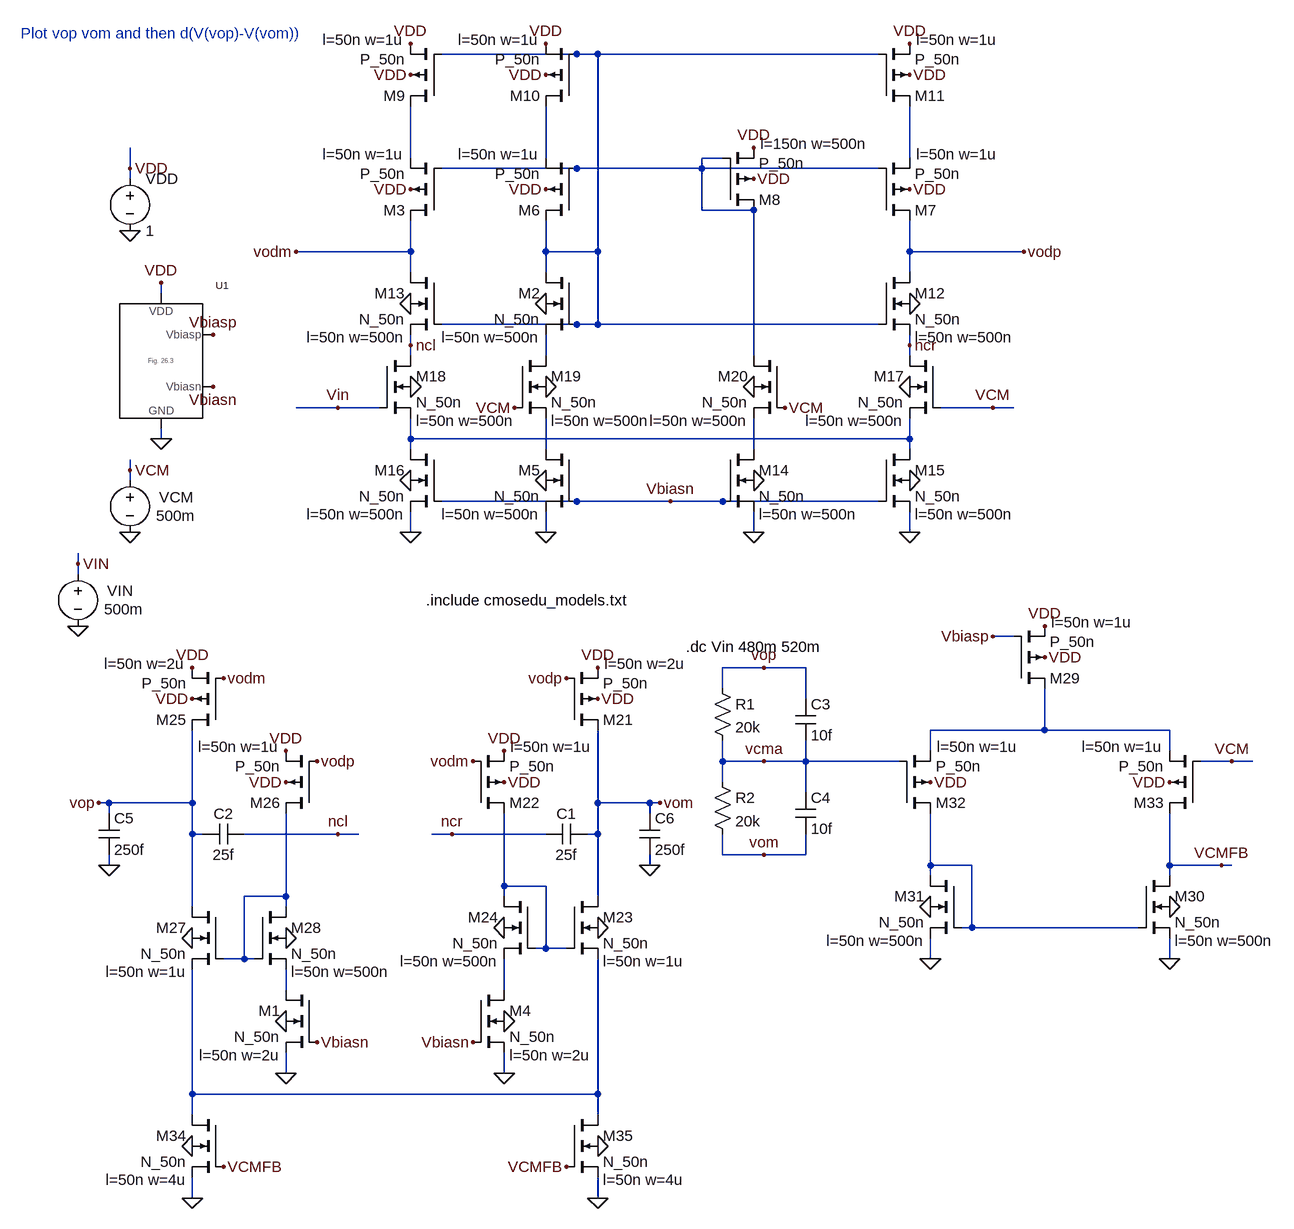
[diagram p0: schematic Fig26_44_DC.asc]
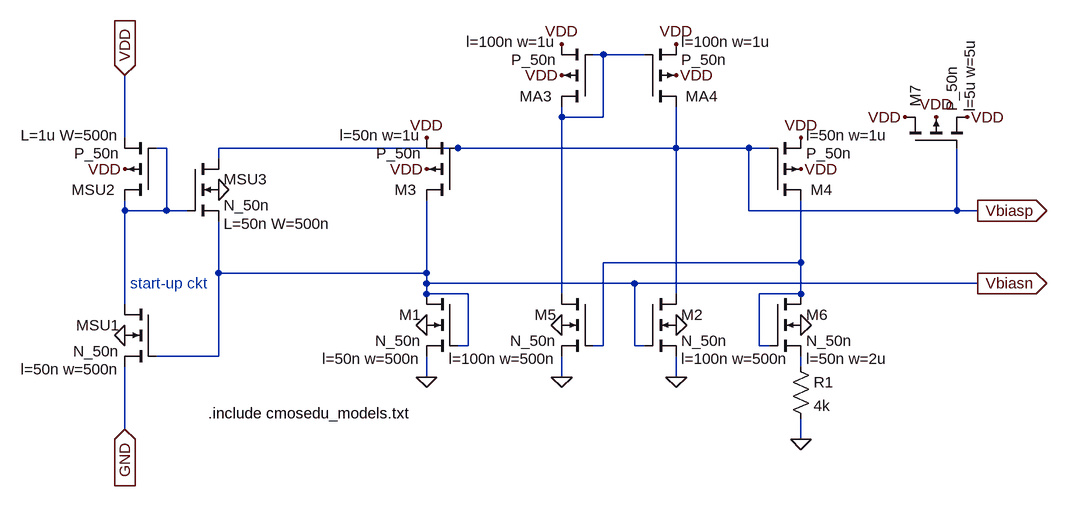
[diagram p1: sub-circuit fig_26_3.asc]
Fig26_44_DC.asc, the LTspice schematic file:
Version 4
SHEET 1 3220 1236
WIRE 1440 -544 1232 -544
WIRE 1472 -544 1440 -544
WIRE 1904 -544 1472 -544
WIRE 1184 -384 1184 -464
WIRE 1392 -384 1392 -464
WIRE 1664 -384 1632 -384
WIRE 1952 -384 1952 -464
WIRE 752 -368 752 -400
WIRE 1440 -368 1232 -368
WIRE 1632 -368 1632 -384
WIRE 1632 -368 1440 -368
WIRE 1904 -368 1632 -368
WIRE 752 -352 752 -368
WIRE 1632 -304 1632 -368
WIRE 1712 -304 1632 -304
WIRE 1184 -240 1184 -288
WIRE 1184 -240 1008 -240
WIRE 1392 -240 1392 -288
WIRE 1472 -240 1472 -544
WIRE 1472 -240 1392 -240
WIRE 1952 -240 1952 -288
WIRE 2128 -240 1952 -240
WIRE 1184 -208 1184 -240
WIRE 1392 -208 1392 -240
WIRE 1952 -208 1952 -240
WIRE 800 -176 800 -192
WIRE 1440 -128 1232 -128
WIRE 1472 -128 1472 -240
WIRE 1472 -128 1440 -128
WIRE 1904 -128 1472 -128
WIRE 1184 -96 1184 -112
WIRE 1952 -96 1952 -112
WIRE 1184 -80 1184 -96
WIRE 1392 -80 1392 -112
WIRE 1712 -80 1712 -304
WIRE 1952 -80 1952 -96
WIRE 1072 0 1008 0
WIRE 1136 0 1072 0
WIRE 2080 0 2000 0
WIRE 2112 0 2080 0
WIRE 800 48 800 32
WIRE 1184 48 1184 16
WIRE 1952 48 1952 16
WIRE 1952 48 1184 48
WIRE 1184 64 1184 48
WIRE 1392 64 1392 16
WIRE 1712 64 1712 16
WIRE 1952 64 1952 48
WIRE 752 96 752 80
WIRE 752 112 752 96
WIRE 1440 144 1232 144
WIRE 1584 144 1440 144
WIRE 1664 144 1584 144
WIRE 1904 144 1664 144
WIRE 1184 192 1184 160
WIRE 1392 192 1392 160
WIRE 1712 192 1712 160
WIRE 1952 192 1952 160
WIRE 672 240 672 224
WIRE 672 256 672 240
WIRE 2112 352 2080 352
WIRE 1728 400 1664 400
WIRE 1792 400 1728 400
WIRE 1664 432 1664 400
WIRE 1792 448 1792 400
WIRE 2160 496 2160 432
WIRE 2160 496 1984 496
WIRE 2352 496 2160 496
WIRE 1984 528 1984 496
WIRE 2352 528 2352 496
WIRE 1664 544 1664 512
WIRE 1728 544 1664 544
WIRE 1792 544 1792 512
WIRE 1792 544 1728 544
WIRE 1936 544 1792 544
WIRE 2448 544 2400 544
WIRE 2480 544 2448 544
WIRE 1664 576 1664 544
WIRE 1792 592 1792 544
WIRE 720 608 704 608
WIRE 848 608 848 496
WIRE 848 608 720 608
WIRE 1472 608 1472 496
WIRE 1552 608 1472 608
WIRE 1568 608 1552 608
WIRE 720 624 720 608
WIRE 1552 624 1552 608
WIRE 848 656 848 608
WIRE 864 656 848 656
WIRE 1072 656 928 656
WIRE 1104 656 1072 656
WIRE 1248 656 1216 656
WIRE 1392 656 1248 656
WIRE 1472 656 1472 608
WIRE 1472 656 1456 656
WIRE 1664 688 1664 656
WIRE 1728 688 1664 688
WIRE 1792 688 1792 656
WIRE 1792 688 1728 688
WIRE 720 704 720 688
WIRE 1552 704 1552 688
WIRE 1984 704 1984 624
WIRE 2048 704 1984 704
WIRE 2352 704 2352 624
WIRE 2432 704 2352 704
WIRE 2448 704 2432 704
WIRE 1984 720 1984 704
WIRE 2352 720 2352 704
WIRE 1328 736 1328 624
WIRE 1392 736 1328 736
WIRE 992 752 992 624
WIRE 992 752 928 752
WIRE 1328 752 1328 736
WIRE 1472 752 1472 656
WIRE 848 768 848 656
WIRE 992 768 992 752
WIRE 2048 800 2048 704
WIRE 2048 800 2032 800
WIRE 2304 800 2048 800
WIRE 1392 832 1392 736
WIRE 1392 832 1376 832
WIRE 1424 832 1392 832
WIRE 928 848 928 752
WIRE 928 848 896 848
WIRE 944 848 928 848
WIRE 1984 848 1984 816
WIRE 2352 848 2352 816
WIRE 992 896 992 864
WIRE 1328 896 1328 848
WIRE 992 1024 992 992
WIRE 1328 1024 1328 992
WIRE 848 1056 848 864
WIRE 1472 1056 1472 848
WIRE 1472 1056 848 1056
WIRE 848 1088 848 1056
WIRE 1472 1088 1472 1056
WIRE 848 1216 848 1184
WIRE 1472 1216 1472 1184
FLAG 752 -272 0
FLAG 752 -368 VDD
FLAG 1392 -160 0
FLAG 1184 -336 VDD
FLAG 800 -192 VDD
FLAG 800 48 0
FLAG 752 192 0
FLAG 880 -32 Vbiasn
FLAG 880 -112 Vbiasp
FLAG 752 96 VCM
FLAG 1392 -336 VDD
FLAG 1952 -336 VDD
FLAG 1712 -400 VDD
FLAG 1712 -352 VDD
FLAG 1184 -512 VDD
FLAG 1184 -560 VDD
FLAG 1392 -512 VDD
FLAG 1392 -560 VDD
FLAG 1952 -560 VDD
FLAG 1952 -512 VDD
FLAG 1952 -160 0
FLAG 1184 -160 0
FLAG 1392 112 0
FLAG 1712 112 0
FLAG 1952 112 0
FLAG 1184 112 0
FLAG 1952 -32 0
FLAG 1184 -32 0
FLAG 1392 -32 0
FLAG 1712 -32 0
FLAG 1184 192 0
FLAG 1584 144 Vbiasn
FLAG 2128 -240 vodp
FLAG 1008 -240 vodm
FLAG 1072 0 Vin
FLAG 2080 0 VCM
FLAG 1952 -96 ncr
FLAG 1184 -96 ncl
FLAG 1472 400 VDD
FLAG 1472 448 VDD
FLAG 1328 528 VDD
FLAG 1328 576 VDD
FLAG 1472 800 0
FLAG 1328 800 0
FLAG 1248 656 ncr
FLAG 1424 416 vodp
FLAG 1280 544 vodm
FLAG 848 400 VDD
FLAG 848 448 VDD
FLAG 992 528 VDD
FLAG 992 576 VDD
FLAG 848 816 0
FLAG 992 816 0
FLAG 1072 656 ncl
FLAG 896 416 vodm
FLAG 1040 544 vodp
FLAG 1392 192 0
FLAG 1952 192 0
FLAG 1712 192 0
FLAG 1728 400 vop
FLAG 1728 688 vom
FLAG 1728 544 vcma
FLAG 2352 848 0
FLAG 2160 336 VDD
FLAG 2160 384 VDD
FLAG 2352 768 0
FLAG 1984 848 0
FLAG 1984 768 0
FLAG 2080 352 Vbiasp
FLAG 1984 576 VDD
FLAG 2352 576 VDD
FLAG 2448 544 VCM
FLAG 848 1136 0
FLAG 896 1168 VCMFB
FLAG 1472 1136 0
FLAG 1424 1168 VCMFB
FLAG 704 608 vop
FLAG 720 704 0
FLAG 1568 608 vom
FLAG 1552 704 0
FLAG 2432 704 VCMFB
FLAG 1344 0 VCM
FLAG 1760 0 VCM
FLAG 992 944 0
FLAG 1040 976 Vbiasn
FLAG 992 1024 0
FLAG 1328 944 0
FLAG 1280 976 Vbiasn
FLAG 1328 1024 0
FLAG 1472 1216 0
FLAG 848 1216 0
FLAG 672 336 0
FLAG 672 240 VIN
SYMBOL voltage 752 -368 R0
WINDOW 123 0 0 Left 2
WINDOW 39 0 0 Left 2
SYMATTR InstName VDD
SYMATTR Value 1
SYMBOL nmos4 1440 -208 M0
WINDOW 123 56 100 Left 2
SYMATTR Value2 l=50n w=500n
SYMATTR InstName M2
SYMATTR Value N_50n
SYMBOL pmos4 1232 -288 R180
WINDOW 123 58 102 Left 2
WINDOW 0 56 16 Left 2
SYMATTR Value2 l=50n w=1u
SYMATTR InstName M3
SYMATTR Value P_50n
SYMBOL voltage 752 96 R0
WINDOW 0 45 42 Left 2
WINDOW 3 40 70 Left 2
WINDOW 123 0 0 Left 2
WINDOW 39 0 0 Left 2
SYMATTR InstName VCM
SYMATTR Value 500m
SYMBOL Fig_26_3 736 -64 R0
SYMATTR InstName U1
SYMBOL pmos4 1440 -288 R180
WINDOW 123 58 102 Left 2
WINDOW 0 56 16 Left 2
SYMATTR Value2 l=50n w=1u
SYMATTR InstName M6
SYMATTR Value P_50n
SYMBOL pmos4 1904 -288 M180
WINDOW 123 58 102 Left 2
WINDOW 0 56 16 Left 2
SYMATTR Value2 l=50n w=1u
SYMATTR InstName M7
SYMATTR Value P_50n
SYMBOL pmos4 1664 -304 M180
WINDOW 123 58 102 Left 2
WINDOW 0 56 16 Left 2
SYMATTR Value2 l=150n w=500n
SYMATTR InstName M8
SYMATTR Value P_50n
SYMBOL pmos4 1232 -464 R180
WINDOW 123 58 102 Left 2
WINDOW 0 56 16 Left 2
SYMATTR Value2 l=50n w=1u
SYMATTR InstName M9
SYMATTR Value P_50n
SYMBOL pmos4 1440 -464 R180
WINDOW 123 58 102 Left 2
WINDOW 0 56 16 Left 2
SYMATTR Value2 l=50n w=1u
SYMATTR InstName M10
SYMATTR Value P_50n
SYMBOL pmos4 1904 -464 M180
WINDOW 123 58 102 Left 2
WINDOW 0 56 16 Left 2
SYMATTR Value2 l=50n w=1u
SYMATTR InstName M11
SYMATTR Value P_50n
SYMBOL nmos4 1904 -208 R0
WINDOW 123 56 100 Left 2
SYMATTR Value2 l=50n w=500n
SYMATTR InstName M12
SYMATTR Value N_50n
SYMBOL nmos4 1232 -208 M0
WINDOW 123 56 100 Left 2
SYMATTR Value2 l=50n w=500n
SYMATTR InstName M13
SYMATTR Value N_50n
SYMBOL nmos4 1440 64 M0
WINDOW 123 56 100 Left 2
SYMATTR Value2 l=50n w=500n
SYMATTR InstName M5
SYMATTR Value N_50n
SYMBOL nmos4 1664 64 R0
WINDOW 123 56 100 Left 2
SYMATTR Value2 l=50n w=500n
SYMATTR InstName M14
SYMATTR Value N_50n
SYMBOL nmos4 1904 64 R0
WINDOW 123 56 100 Left 2
SYMATTR Value2 l=50n w=500n
SYMATTR InstName M15
SYMATTR Value N_50n
SYMBOL nmos4 1232 64 M0
WINDOW 123 56 100 Left 2
SYMATTR Value2 l=50n w=500n
SYMATTR InstName M16
SYMATTR Value N_50n
SYMBOL nmos4 2000 -80 M0
WINDOW 123 56 100 Left 2
SYMATTR Value2 l=50n w=500n
SYMATTR InstName M17
SYMATTR Value N_50n
SYMBOL nmos4 1136 -80 R0
WINDOW 123 56 100 Left 2
SYMATTR Value2 l=50n w=500n
SYMATTR InstName M18
SYMATTR Value N_50n
SYMBOL nmos4 1344 -80 R0
WINDOW 123 56 100 Left 2
SYMATTR Value2 l=50n w=500n
SYMATTR InstName M19
SYMATTR Value N_50n
SYMBOL nmos4 1760 -80 M0
WINDOW 123 56 100 Left 2
SYMATTR Value2 l=50n w=500n
SYMATTR InstName M20
SYMATTR Value N_50n
SYMBOL pmos4 1424 496 M180
WINDOW 123 58 102 Left 2
WINDOW 0 56 16 Left 2
SYMATTR Value2 l=50n w=2u
SYMATTR InstName M21
SYMATTR Value P_50n
SYMBOL pmos4 1280 624 M180
WINDOW 123 58 102 Left 2
WINDOW 0 56 16 Left 2
SYMATTR Value2 l=50n w=1u
SYMATTR InstName M22
SYMATTR Value P_50n
SYMBOL nmos4 1424 752 R0
WINDOW 123 56 100 Left 2
SYMATTR Value2 l=50n w=1u
SYMATTR InstName M23
SYMATTR Value N_50n
SYMBOL nmos4 1376 752 M0
WINDOW 123 56 100 Left 2
SYMATTR Value2 l=50n w=500n
SYMATTR InstName M24
SYMATTR Value N_50n
SYMBOL cap 1456 640 R90
WINDOW 0 0 32 VBottom 2
WINDOW 3 32 32 VTop 2
SYMATTR InstName C1
SYMATTR Value 25f
SYMBOL pmos4 896 496 R180
WINDOW 123 58 102 Left 2
WINDOW 0 56 16 Left 2
SYMATTR Value2 l=50n w=2u
SYMATTR InstName M25
SYMATTR Value P_50n
SYMBOL pmos4 1040 624 R180
WINDOW 123 58 102 Left 2
WINDOW 0 56 16 Left 2
SYMATTR Value2 l=50n w=1u
SYMATTR InstName M26
SYMATTR Value P_50n
SYMBOL nmos4 896 768 M0
WINDOW 123 56 100 Left 2
SYMATTR Value2 l=50n w=1u
SYMATTR InstName M27
SYMATTR Value N_50n
SYMBOL nmos4 944 768 R0
WINDOW 123 56 100 Left 2
SYMATTR Value2 l=50n w=500n
SYMATTR InstName M28
SYMATTR Value N_50n
SYMBOL cap 864 640 M90
WINDOW 0 0 32 VBottom 2
WINDOW 3 32 32 VTop 2
SYMATTR InstName C2
SYMATTR Value 25f
SYMBOL res 1648 416 R0
SYMATTR InstName R1
SYMATTR Value 20k
SYMBOL res 1648 560 R0
SYMATTR InstName R2
SYMATTR Value 20k
SYMBOL cap 1776 448 R0
SYMATTR InstName C3
SYMATTR Value 10f
SYMBOL cap 1776 592 R0
SYMATTR InstName C4
SYMATTR Value 10f
SYMBOL pmos4 2112 432 M180
WINDOW 123 58 102 Left 2
WINDOW 0 56 16 Left 2
SYMATTR Value2 l=50n w=1u
SYMATTR InstName M29
SYMATTR Value P_50n
SYMBOL nmos4 2304 720 R0
WINDOW 123 56 100 Left 2
SYMATTR Value2 l=50n w=500n
SYMATTR InstName M30
SYMATTR Value N_50n
SYMBOL nmos4 2032 720 M0
WINDOW 123 56 100 Left 2
SYMATTR Value2 l=50n w=500n
SYMATTR InstName M31
SYMATTR Value N_50n
SYMBOL pmos4 1936 624 M180
WINDOW 123 58 102 Left 2
WINDOW 0 56 16 Left 2
SYMATTR Value2 l=50n w=1u
SYMATTR InstName M32
SYMATTR Value P_50n
SYMBOL pmos4 2400 624 R180
WINDOW 123 58 102 Left 2
WINDOW 0 56 16 Left 2
SYMATTR Value2 l=50n w=1u
SYMATTR InstName M33
SYMATTR Value P_50n
SYMBOL nmos4 896 1088 M0
WINDOW 123 56 100 Left 2
SYMATTR Value2 l=50n w=4u
SYMATTR InstName M34
SYMATTR Value N_50n
SYMBOL nmos4 1424 1088 R0
WINDOW 123 56 100 Left 2
SYMATTR Value2 l=50n w=4u
SYMATTR InstName M35
SYMATTR Value N_50n
SYMBOL cap 704 624 R0
SYMATTR InstName C5
SYMATTR Value 250f
SYMBOL cap 1536 624 R0
SYMATTR InstName C6
SYMATTR Value 250f
SYMBOL nmos4 1040 896 M0
WINDOW 123 56 100 Left 2
SYMATTR Value2 l=50n w=2u
SYMATTR InstName M1
SYMATTR Value N_50n
SYMBOL nmos4 1280 896 R0
WINDOW 123 56 100 Left 2
SYMATTR Value2 l=50n w=2u
SYMATTR InstName M4
SYMATTR Value N_50n
SYMBOL voltage 672 240 R0
WINDOW 0 45 42 Left 2
WINDOW 3 40 70 Left 2
WINDOW 123 0 0 Left 2
WINDOW 39 0 0 Left 2
SYMATTR InstName VIN
SYMATTR Value 500m
TEXT 1208 296 Left 2 !.include cmosedu_models.txt
TEXT 1608 368 Left 2 !.dc Vin 480m 520m
TEXT 584 -576 Left 2 ;Plot vop vom and then d(V(vop)-V(vom))

fig_26_3.asc, the sub-circuit schematic file:
Version 4
SHEET 1 2004 680
WIRE 1280 -304 1264 -304
WIRE 1344 -304 1280 -304
WIRE 1216 -208 1216 -224
WIRE 1280 -208 1280 -304
WIRE 1280 -208 1216 -208
WIRE 544 -176 544 -272
WIRE 608 -160 592 -160
WIRE 1056 -160 688 -160
WIRE 1392 -160 1392 -224
WIRE 1392 -160 1056 -160
WIRE 1504 -160 1392 -160
WIRE 1536 -160 1504 -160
WIRE 688 -144 688 -160
WIRE 544 -64 544 -80
WIRE 608 -64 608 -160
WIRE 608 -64 544 -64
WIRE 640 -64 608 -64
WIRE 1504 -64 1504 -160
WIRE 1824 -64 1824 -160
WIRE 1824 -64 1504 -64
WIRE 1856 -64 1824 -64
WIRE 1584 16 1584 -80
WIRE 1584 16 1280 16
WIRE 688 32 688 -48
WIRE 1008 32 1008 -80
WIRE 1008 32 688 32
WIRE 1008 48 1008 32
WIRE 1328 48 1008 48
WIRE 1856 48 1328 48
WIRE 1008 64 1008 48
WIRE 1072 64 1008 64
WIRE 1216 64 1216 -208
WIRE 1392 64 1392 -160
WIRE 1584 64 1584 16
WIRE 1584 64 1520 64
WIRE 544 80 544 -64
WIRE 1072 144 1072 64
WIRE 1072 144 1056 144
WIRE 1280 144 1280 16
WIRE 1280 144 1264 144
WIRE 1328 144 1328 48
WIRE 1344 144 1328 144
WIRE 1520 144 1520 64
WIRE 1536 144 1520 144
WIRE 688 160 688 32
WIRE 688 160 592 160
WIRE 1584 176 1584 160
WIRE 1008 192 1008 160
WIRE 1216 192 1216 160
WIRE 1392 192 1392 160
WIRE 544 272 544 176
WIRE 1584 288 1584 256
FLAG 544 -128 VDD
FLAG 1008 -128 VDD
FLAG 1008 -176 VDD
FLAG 1584 -128 VDD
FLAG 1584 -176 VDD
FLAG 1584 288 0
FLAG 1584 112 0
FLAG 1392 -272 VDD
FLAG 1392 -320 VDD
FLAG 1216 -272 VDD
FLAG 1216 -320 VDD
FLAG 1392 112 0
FLAG 1792 -208 VDD
FLAG 1744 -208 VDD
FLAG 1840 -208 VDD
FLAG 544 -272 VDD
IOPIN 544 -272 In
FLAG 544 272 GND
IOPIN 544 272 In
FLAG 688 -96 0
FLAG 544 128 0
FLAG 1008 192 0
FLAG 1008 112 0
FLAG 1216 112 0
FLAG 1216 192 0
FLAG 1392 192 0
FLAG 1856 -64 Vbiasp
IOPIN 1856 -64 Out
FLAG 1856 48 Vbiasn
IOPIN 1856 48 Out
SYMBOL pmos4 592 -80 R180
WINDOW 0 63 16 Left 2
WINDOW 123 56 100 Left 2
SYMATTR InstName MSU2
SYMATTR Value2 L=1u W=500n
SYMATTR Value P_50n
SYMBOL nmos4 592 80 M0
WINDOW 123 56 100 Left 2
SYMATTR Value2 l=50n w=500n
SYMATTR InstName MSU1
SYMATTR Value N_50n
SYMBOL nmos4 640 -144 R0
WINDOW 123 56 100 Left 2
SYMATTR Value2 L=50n W=500n
SYMATTR InstName MSU3
SYMATTR Value N_50n
SYMBOL pmos4 1056 -80 R180
WINDOW 0 63 16 Left 2
WINDOW 123 56 100 Left 2
SYMATTR InstName M3
SYMATTR Value2 l=50n w=1u
SYMATTR Value P_50n
SYMBOL pmos4 1536 -80 M180
WINDOW 0 63 16 Left 2
WINDOW 123 56 100 Left 2
SYMATTR InstName M4
SYMATTR Value2 l=50n w=1u
SYMATTR Value P_50n
SYMBOL nmos4 1056 64 M0
WINDOW 123 56 100 Left 2
SYMATTR Value2 l=50n w=500n
SYMATTR InstName M1
SYMATTR Value N_50n
SYMBOL res 1568 160 R0
SYMATTR InstName R1
SYMATTR Value 4k
SYMBOL pmos4 1344 -224 M180
WINDOW 0 63 16 Left 2
WINDOW 123 56 100 Left 2
SYMATTR InstName MA4
SYMATTR Value2 l=100n w=1u
SYMATTR Value P_50n
SYMBOL pmos4 1264 -224 R180
WINDOW 0 63 16 Left 2
WINDOW 123 56 100 Left 2
SYMATTR InstName MA3
SYMATTR Value2 l=100n w=1u
SYMATTR Value P_50n
SYMBOL nmos4 1264 64 M0
WINDOW 123 56 100 Left 2
SYMATTR Value2 l=100n w=500n
SYMATTR InstName M5
SYMATTR Value N_50n
SYMBOL pmos4 1744 -160 R270
WINDOW 0 63 16 Left 2
WINDOW 123 56 100 Left 2
SYMATTR InstName M7
SYMATTR Value2 l=5u w=5u
SYMATTR Value P_50n
SYMBOL nmos4 1344 64 R0
WINDOW 123 56 100 Left 2
SYMATTR Value2 l=100n w=500n
SYMATTR InstName M2
SYMATTR Value N_50n
SYMBOL nmos4 1536 64 R0
WINDOW 123 56 100 Left 2
SYMATTR Value2 l=50n w=2u
SYMATTR InstName M6
SYMATTR Value N_50n
TEXT 552 48 Left 2 ;start-up ckt
TEXT 672 248 Left 2 !.include cmosedu_models.txt

The netlist it stands for:
* Fig26_44_DC.asc
VDD VDD 0 1
M2 N001 N001 N006 0 N_50n l=50n w=500n
M3 vodm N004 N002 VDD P_50n l=50n w=1u
VCM VCM 0 500m
XU1 Vbiasn Vbiasp VDD 0 fig_26_3
M6 N001 N004 N003 VDD P_50n l=50n w=1u
M7 vodp N004 N005 VDD P_50n l=50n w=1u
M8 N004 N004 VDD VDD P_50n l=150n w=500n
M9 N002 N001 VDD VDD P_50n l=50n w=1u
M10 N003 N001 VDD VDD P_50n l=50n w=1u
M11 N005 N001 VDD VDD P_50n l=50n w=1u
M12 vodp N001 ncr 0 N_50n l=50n w=500n
M13 vodm N001 ncl 0 N_50n l=50n w=500n
M5 N008 Vbiasn 0 0 N_50n l=50n w=500n
M14 N009 Vbiasn 0 0 N_50n l=50n w=500n
M15 N007 Vbiasn 0 0 N_50n l=50n w=500n
M16 N007 Vbiasn 0 0 N_50n l=50n w=500n
M17 ncr VCM N007 0 N_50n l=50n w=500n
M18 ncl Vin N007 0 N_50n l=50n w=500n
M19 N006 VCM N008 0 N_50n l=50n w=500n
M20 N004 VCM N009 0 N_50n l=50n w=500n
M21 vom vodp VDD VDD P_50n l=50n w=2u
M22 N012 vodm VDD VDD P_50n l=50n w=1u
M23 vom N012 N016 0 N_50n l=50n w=1u
M24 N012 N012 N015 0 N_50n l=50n w=500n
C1 vom ncr 25f
M25 vop vodm VDD VDD P_50n l=50n w=2u
M26 N013 vodp VDD VDD P_50n l=50n w=1u
M27 vop N013 N016 0 N_50n l=50n w=1u
M28 N013 N013 N014 0 N_50n l=50n w=500n
C2 vop ncl 25f
R1 vop vcma 20k
R2 vcma vom 20k
C3 vop vcma 10f
C4 vcma vom 10f
M29 N010 Vbiasp VDD VDD P_50n l=50n w=1u
M30 VCMFB N011 0 0 N_50n l=50n w=500n
M31 N011 N011 0 0 N_50n l=50n w=500n
M32 N011 vcma N010 VDD P_50n l=50n w=1u
M33 VCMFB VCM N010 VDD P_50n l=50n w=1u
M34 N016 VCMFB 0 0 N_50n l=50n w=4u
M35 N016 VCMFB 0 0 N_50n l=50n w=4u
C5 vop 0 250f
C6 vom 0 250f
M1 N014 Vbiasn 0 0 N_50n l=50n w=2u
M4 N015 Vbiasn 0 0 N_50n l=50n w=2u
VIN Vin 0 500m

* block symbol definitions
.subckt fig_26_3 Vbiasn Vbiasp VDD GND
MSU2 N002 N002 VDD VDD P_50n L=1u W=500n
MSU1 N002 Vbiasn GND 0 N_50n l=50n w=500n
MSU3 Vbiasp N002 Vbiasn 0 N_50n L=50n W=500n
M3 Vbiasn Vbiasp VDD VDD P_50n l=50n w=1u
M4 N003 Vbiasp VDD VDD P_50n l=50n w=1u
M1 Vbiasn Vbiasn 0 0 N_50n l=50n w=500n
R1 N004 0 4k
MA4 Vbiasp N001 VDD VDD P_50n l=100n w=1u
MA3 N001 N001 VDD VDD P_50n l=100n w=1u
M5 N001 N003 0 0 N_50n l=100n w=500n
M7 VDD Vbiasp VDD VDD P_50n l=5u w=5u
M2 Vbiasp Vbiasn 0 0 N_50n l=100n w=500n
M6 N003 N003 N004 0 N_50n l=50n w=2u
* start-up ckt
.include cmosedu_models.txt
.ends fig_26_3

.model NMOS NMOS
.model PMOS PMOS
.lib standard.mos
.include cmosedu_models.txt
.dc Vin 480m 520m
* Plot vop vom and then d(V(vop)-V(vom))
.backanno
.end